# EAGLE schematic OSC (EAGLE 9.6.0)

## Sheet 1 of 5: Power Land
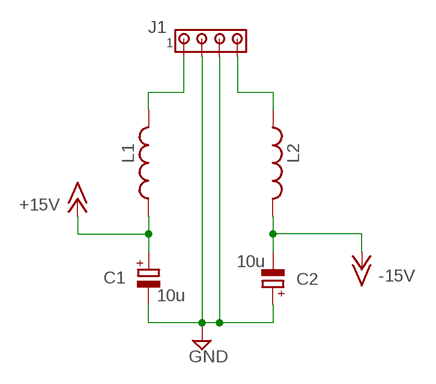
[diagram p0: schematic, sheet 1]

### Parts
C1  10u  CPOL-EUE1.8-4  [E1,8-4]
C2  10u  CPOL-EUE1.8-4  [E1,8-4]
J1  MTA04-156  [1X4MTA]
L1  L-US0207/10  [0207/10]
L2  L-US0207/10  [0207/10]

### Nets
+15V: C1.+ L1.2 ; also sheet 2,3
-15V: C2.- L2.2 ; also sheet 2,3
GND: C1.- C2.+ J1.2 J1.3 ; also sheet 2,3
N$3: J1.1 L1.1
N$4: J1.4 L2.1

## Sheet 2 of 5: Oscillator A
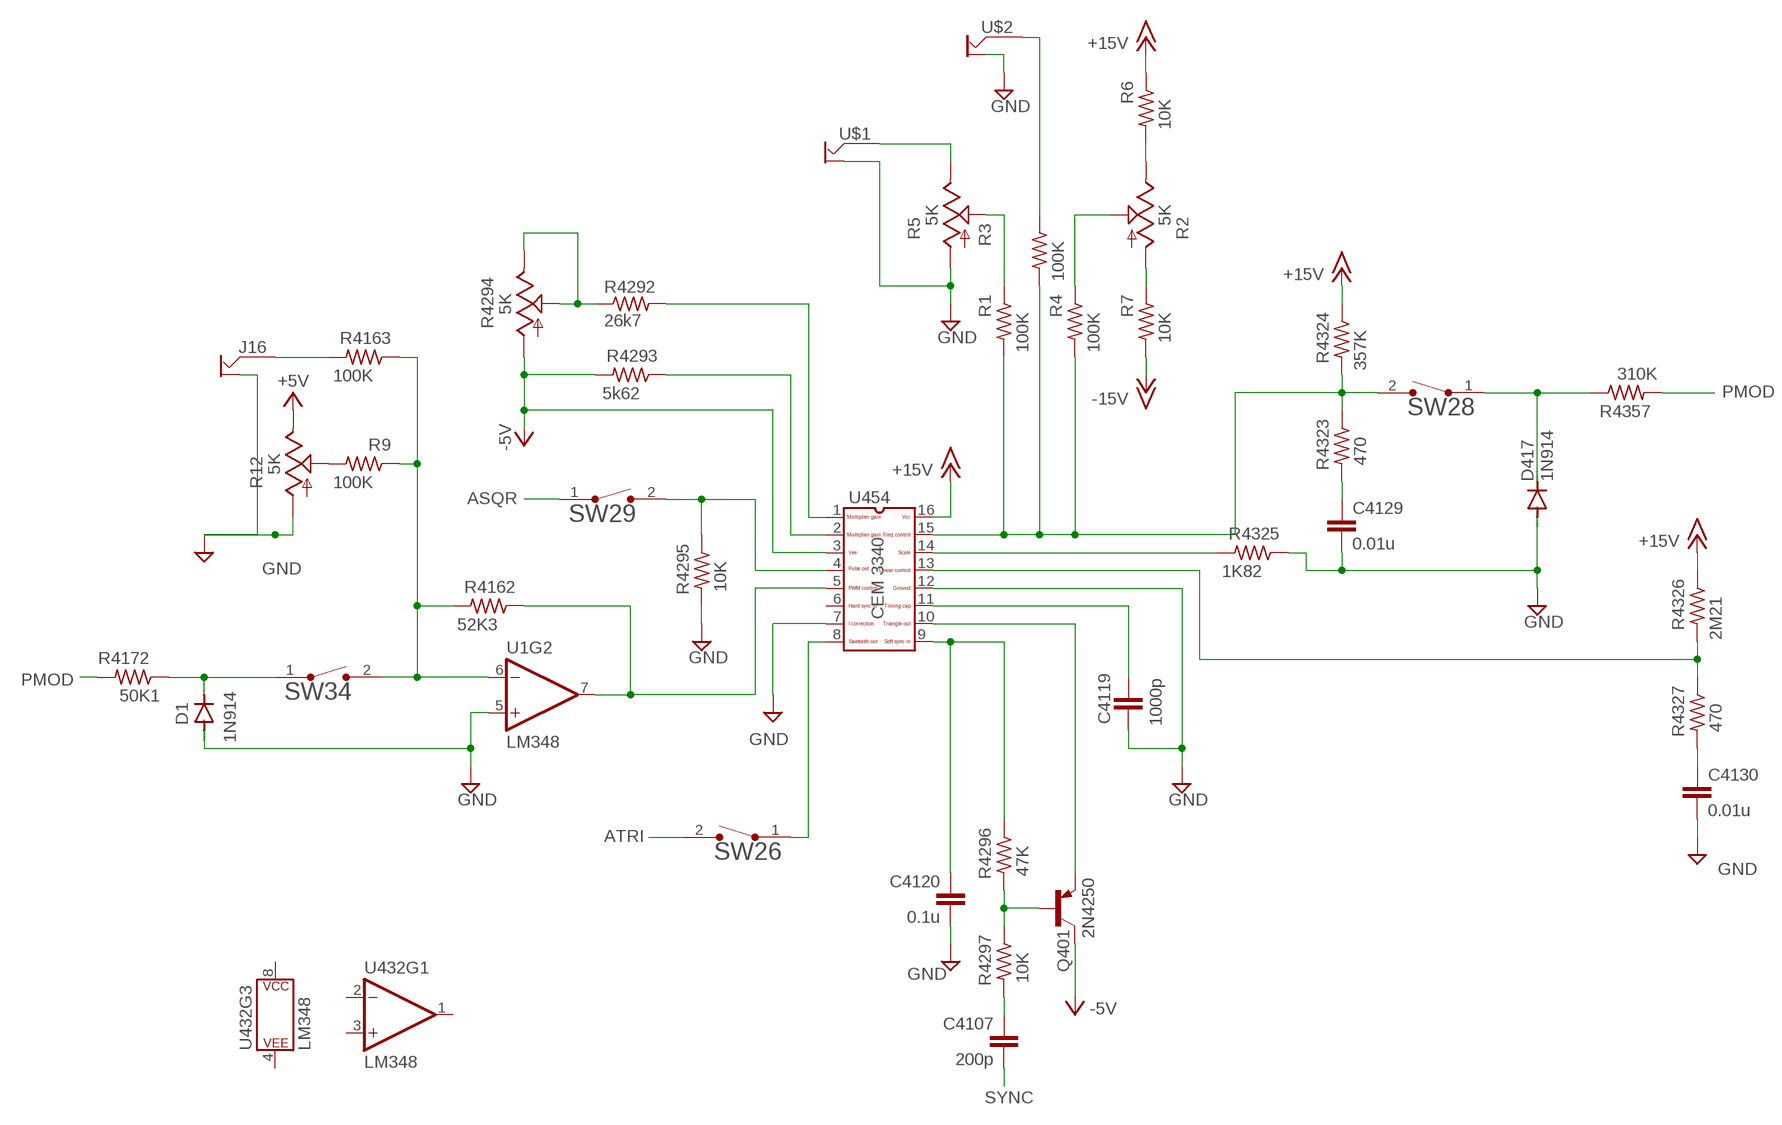
[diagram p1: schematic, sheet 2]

### Parts
C4107  200p  C-EU050-025X075  [C050-025X075]
C4119  1000p  C-EU050-025X075  [C050-025X075]
C4120  0.1u  C-EU050-025X075  [C050-025X075]
C4129  0.01u  C-EU050-025X075  [C050-025X075]
C4130  0.01u  C-EU050-025X075  [C050-025X075]
D1  1N914  1N4148DO35-10  [DO35-10]
D417  1N914  1N4148DO35-10  [DO35-10]
J16  JACK  [SIG_OB]
Q401  2N4250  2N4250A  [TO18]
R1  100K  R-US_0207/10  [0207/10]
R2  5K  POT  [POT_OB]
R3  100K  R-US_0207/10  [0207/10]
R4  100K  R-US_0207/10  [0207/10]
R5  5K  POT  [POT_OB]
R6  10K  R-US_0207/10  [0207/10]
R7  10K  R-US_0207/10  [0207/10]
R9  100K  R-US_0207/10  [0207/10]
R12  5K  POT  [POT_OB]
R4162  52K3  R-US_0207/10  [0207/10]
R4163  100K  R-US_0207/10  [0207/10]
R4172  50K1  R-US_0207/10  [0207/10]
R4292  26k7  R-US_0207/10  [0207/10]
R4293  5k62  R-US_0207/10  [0207/10]
R4294  5K  POT  [POT_OB]
R4295  10K  R-US_0207/10  [0207/10]
R4296  47K  R-US_0207/10  [0207/10]
R4297  10K  R-US_0207/10  [0207/10]
R4323  470  R-US_0207/10  [0207/10]
R4324  357K  R-US_0207/10  [0207/10]
R4325  1K82  R-US_0207/10  [0207/10]
R4326  2M21  R-US_0207/10  [0207/10]
R4327  470  R-US_0207/10  [0207/10]
R4357  310K  R-US_0207/10  [0207/10]
SW26  SPST  [SPST_OB]
SW28  SPST  [SPST_OB]
SW29  SPST  [SPST_OB]
SW34  SPST  [SPST_OB]
U1  LM348  LM358  [DIP08]
U432  LM348  LM358  [DIP08]
U454  CEM3340  [DIL16]
U$1  JACK  [SIG_OB]
U$2  JACK  [SIG_OB]

### Nets
+5V: R12.2(E)
+15V: R6.1 R4324.1 R4326.1 U454.16 ; also sheet 1,3
-5V: Q401.3(C) R4293.2 R4294.1(A) U454.3 ; also sheet 3
-15V: R7.2 ; also sheet 1,3
ASQR: SW29.1
ATRI: SW26.2
GND: C4119.2 C4120.2 C4129.2 C4130.2 D1.A D417.A J16.GND R5.1(A) R12.1(A) R4295.2 R4325.1 U1.5(+IN) U454.7 U454.12 U$1.GND U$2.GND ; also sheet 1,3
N$1: R4292.2 U454.1
N$2: R4293.1 U454.2
N$5: R4292.1 R4294.2(E) R4294.3(S)
N$6: R4295.1 SW29.2 U454.4
N$7: SW26.1 U454.8
N$8: R1.2 R3.2 R4.2 R4323.1 R4324.2 SW28.2 U454.15
N$9: D417.C R4357.1 SW28.1
N$10: R1.1 R5.3(S)
N$11: R5.2(E) U$1.SIGNAL
N$12: R2.3(S) R4.1
N$13: R2.1(A) R7.1
N$14: R2.2(E) R6.2
N$15: R3.1 U$2.SIGNAL
N$16: C4129.1 R4323.2
N$17: R4325.2 U454.14
N$18: R4326.2 R4327.1 U454.13
N$19: C4130.1 R4327.2
N$20: C4119.1 U454.11
N$21: Q401.1(E) U454.10
N$22: C4120.1 R4296.1 U454.9
N$23: Q401.2(B) R4296.2 R4297.1
N$24: C4107.1 R4297.2
N$26: R4162.1 U1.7(OUT) U454.5
N$28: R9.1 R4162.2 R4163.1 SW34.2 U1.6(-IN)
N$29: D1.C R4172.1 SW34.1
N$30: J16.SIGNAL R4163.2
N$31: R9.2 R12.3(S)
PMOD: R4172.2 R4357.2
SYNC: C4107.2 ; also sheet 3
Unconnected: U1.1(OUT) U1.2(-IN) U1.3(+IN) U1.4(P$V-) U1.8(P$V+) U432.1(OUT) U432.2(-IN) U432.3(+IN) U432.4(P$V-) U432.5(+IN) U432.6(-IN) U432.7(OUT) U432.8(P$V+) U454.6

## Sheet 3 of 5: Oscillator B
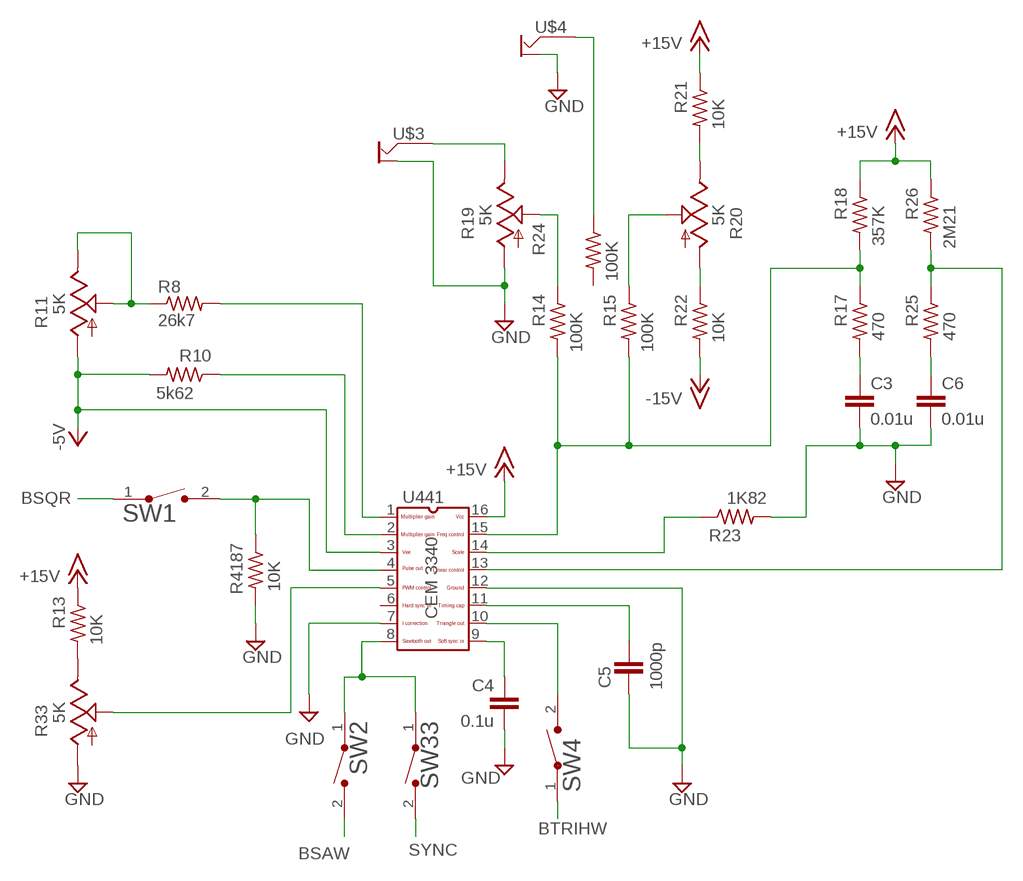
[diagram p2: schematic, sheet 3]

### Parts
C3  0.01u  C-EU050-025X075  [C050-025X075]
C4  0.1u  C-EU050-025X075  [C050-025X075]
C5  1000p  C-EU050-025X075  [C050-025X075]
C6  0.01u  C-EU050-025X075  [C050-025X075]
R8  26k7  R-US_0207/10  [0207/10]
R10  5k62  R-US_0207/10  [0207/10]
R11  5K  POT  [POT_OB]
R13  10K  R-US_0207/10  [0207/10]
R14  100K  R-US_0207/10  [0207/10]
R15  100K  R-US_0207/10  [0207/10]
R17  470  R-US_0207/10  [0207/10]
R18  357K  R-US_0207/10  [0207/10]
R19  5K  POT  [POT_OB]
R20  5K  POT  [POT_OB]
R21  10K  R-US_0207/10  [0207/10]
R22  10K  R-US_0207/10  [0207/10]
R23  1K82  R-US_0207/10  [0207/10]
R24  100K  R-US_0207/10  [0207/10]
R25  470  R-US_0207/10  [0207/10]
R26  2M21  R-US_0207/10  [0207/10]
R33  5K  POT  [POT_OB]
R4187  10K  R-US_0207/10  [0207/10]
SW1  SPST  [SPST_OB]
SW2  SPST  [SPST_OB]
SW4  SPST  [SPST_OB]
SW33  SPST  [SPST_OB]
U441  CEM3340  [DIL16]
U$3  JACK  [SIG_OB]
U$4  JACK  [SIG_OB]

### Nets
+15V: R13.1 R18.1 R21.1 R26.1 U441.16 ; also sheet 1,2
-5V: R10.2 R11.1(A) U441.3 ; also sheet 2
-15V: R22.2 ; also sheet 1,2
BSAW: SW2.2
BSQR: SW1.1
BTRIHW: SW4.1
GND: C3.2 C4.2 C5.2 C6.2 R19.1(A) R23.2 R33.1(A) R4187.2 U441.7 U441.12 U$3.GND U$4.GND ; also sheet 1,2
N$27: R8.1 R11.2(E) R11.3(S)
N$32: R4187.1 SW1.2 U441.4
N$33: SW2.1 SW33.1 U441.8
N$34: R8.2 U441.1
N$35: R10.1 U441.2
N$36: R25.1 R26.2 U441.13
N$38: R14.1 R19.3(S)
N$39: R19.2(E) U$3.SIGNAL
N$40: R15.1 R20.3(S)
N$41: R20.1(A) R22.1
N$42: R20.2(E) R21.2
N$43: C3.1 R17.2
N$44: R24.1 U$4.SIGNAL
N$45: R14.2 R15.2 R17.1 R18.2 U441.15
N$46: R23.1 U441.14
N$47: C6.1 R25.2
N$48: C5.1 U441.11
N$49: SW4.2 U441.10
N$50: C4.1 U441.9
N$54: R33.3(S) U441.5
N$55: R13.2 R33.2(E)
SYNC: SW33.2 ; also sheet 2
Unconnected: R24.2 U441.6

## Sheet 4 of 5: VCA 3280 Sum
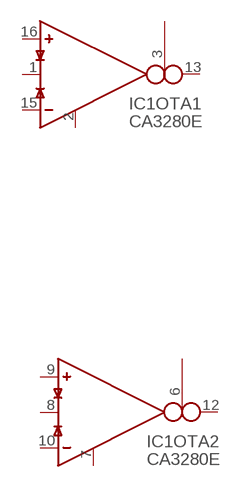
[diagram p3: schematic, sheet 4]

### Parts
IC1  CA3280E  [DIL16]
Unconnected: IC1.1(OTA1:I_DIODE) IC1.2(OTA1:NODE_X) IC1.3(OTA1:I_BIAS) IC1.4(SUPPLY1:V-) IC1.6(OTA2:I_BIAS) IC1.7(OTA2:NODE_X) IC1.8(OTA2:I_DIODE) IC1.9(OTA2:IN_P) IC1.10(OTA2:IN_N) IC1.11(SUPPLY2:V+) IC1.12(OTA2:OUT) IC1.13(OTA1:OUT) IC1.14(SUPPLY1:V+) IC1.15(OTA1:IN_N) IC1.16(OTA1:IN_P)

## Sheet 5 of 5: DC Level Shifter

## Library data of the parts
C1 C2 = rcl:CPOL-EU: POLARIZED CAPACITOR, European symbol; SPICEPREFIX: C
C3-C6 C4107 C4119 C4120 C4129 C4130 = rcl:C-EU: CAPACITOR, European symbol; SPICEPREFIX: C
D1 D417 = diode:1N4148: DIODE high speed (Philips)
IC1 = ota:CA3280: Dual OTA
J1 = con-amp:MTA04-156: AMP connector
J16 U$1-U$4 = aaron:JACK
L1 L2 = rcl:L-US: INDUCTOR, American symbol; SPICEPREFIX: L
Q401 = transistor-pnp:2N4250A: PNP Transistor
R1 R3 R4 R6 R7 R9 R10 R13-R15 R17 R18 R21-R26 R4162 R4163 R4172 R4187 R4293 R4295-R4297 R4323-R4327 R4357 = resistor:R-US_: RESISTOR, American symbol; SPICEPREFIX: R
R2 R5 R11 R12 R19 R20 R33 R4294 = aaron:POT: POTENTIOMETER
R8 R4292 = resistor:R-US_: RESISTOR, American symbol
SW1 SW2 SW4 SW26 SW28 SW29 SW33 SW34 = aaron:SPST
U1 U432 = SparkFun-IC-Amplifiers:LM358: LM358 Jellybean op-amp Datasheet <http://www.sparkfun.com/datasheets/Components/General/LM358.pdf> SparkFun Products Op-Amp (Thru-Hole) - LM358 <https://www.sparkfun.com/products/9456> (COM-09456); PROD_ID: IC-09172; VALUE: LM358
U441 U454 = CEM:CEM3340: CEM 3340 VCO